# Altium schematic sheet My_CryStal.SchDoc: F103C8T6
size A4; Revision: HPP.纸飞机; Num: 20161008.01
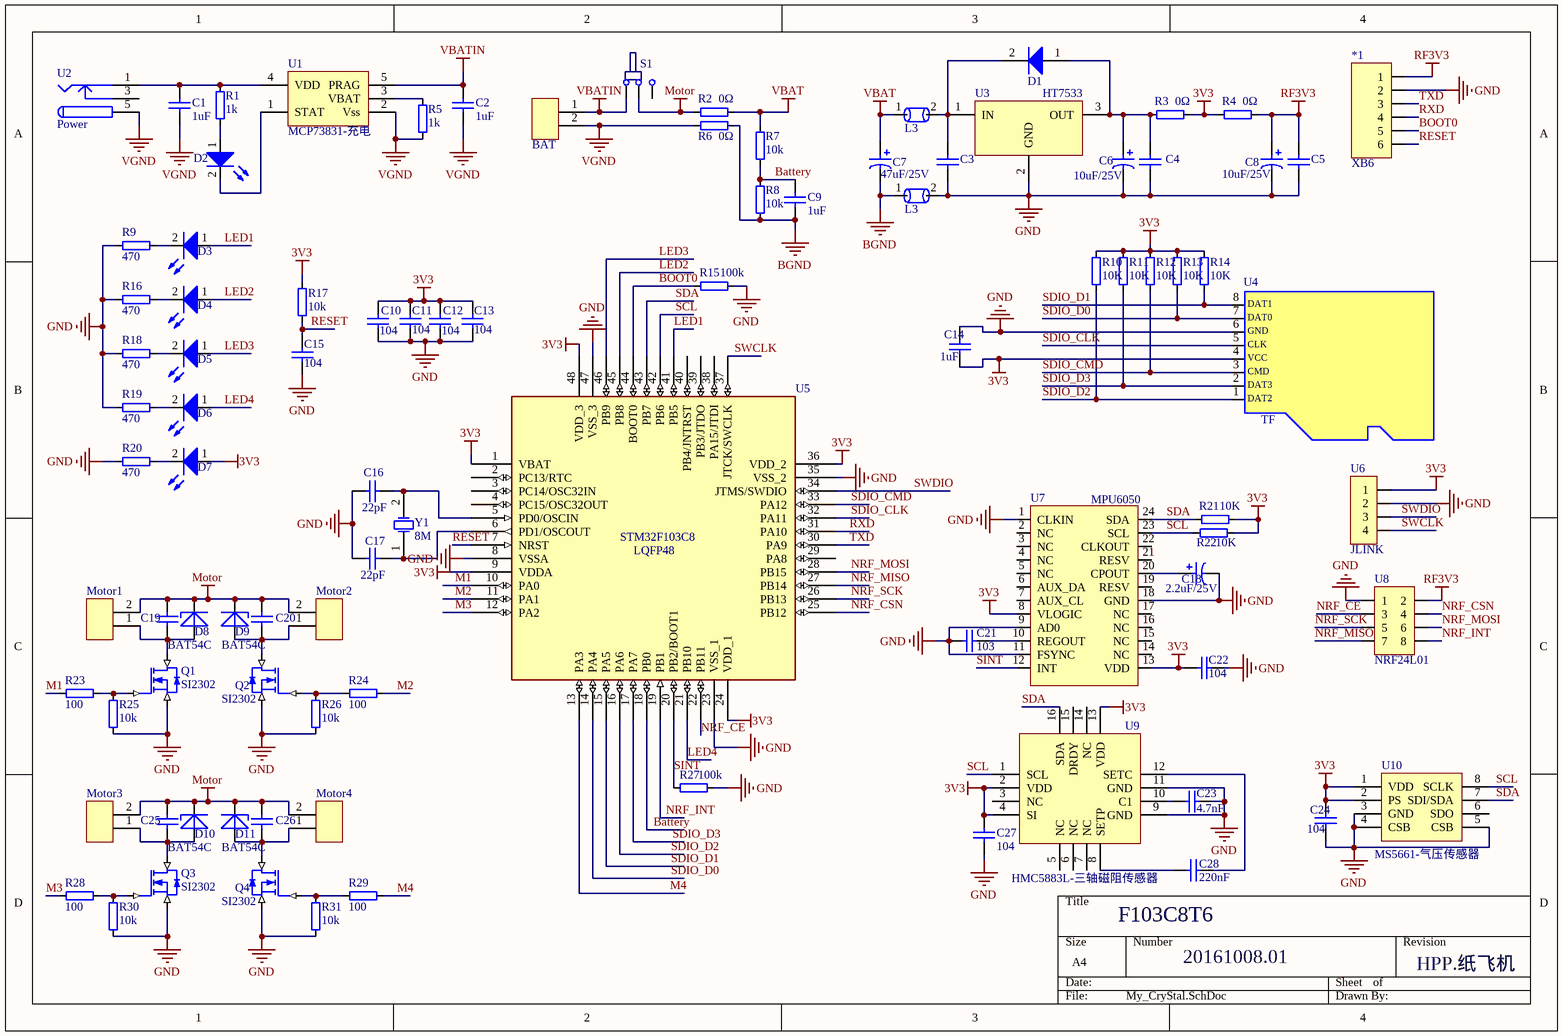
[diagram p0: My_CryStal.SchDoc]

## Parts
*1  XB6  [SIP6]
*2  L3  [2010]
*3  L3  [2010]
C1  1uF  [0805 - duplicate]
C2  1uF  [0805 - duplicate]
C3  104  [0805 - duplicate]  (value not drawn)
C4  104  [0805 - duplicate]  (value not drawn)
C5  104  [0805 - duplicate]  (value not drawn)
C6  10uF/25V  [1206]
C7  47uF/25V  [1206]
C8  10uF/25V  [1206]
C9  1uF  [0805 - duplicate]
C10  104  [0805 - duplicate]
C11  104  [0805 - duplicate]
C12  104  [0805 - duplicate]
C13  104  [0805 - duplicate]
C14  1uF  [0805 - duplicate]
C15  104  [0805 - duplicate]
C16  value 22pF  [0805 - duplicate]  (hidden comment: Cap)
C17  value 22pF  [0805 - duplicate]  (hidden comment: Cap)
C18  2.2uF/25V  [1206]
C19  104  [0805 - duplicate]  (value not drawn)
C20  104  [0805 - duplicate]  (value not drawn)
C21  103  [0805 - duplicate]
C22  104  [0805 - duplicate]
C23  4.7nF  [0805 - duplicate]
C24  104  [0805 - duplicate]
C25  104  [0805 - duplicate]  (value not drawn)
C26  104  [0805 - duplicate]  (value not drawn)
C27  104  [0805 - duplicate]
C28  220nF  [0805 - duplicate]
CON1  BAT  [SIP2]
CON2  Motor1  [SIP2]
CON3  Motor2  [SIP2]
CON4  Motor3  [SIP2]
CON5  Motor4  [SIP2]
D1  Diode  [DIODE-SMB]  (value not drawn)
D2  LED  [LED]  (value not drawn)
D3  LED  [LED]  (value not drawn)
D4  LED  [LED]  (value not drawn)
D5  LED  [LED]  (value not drawn)
D6  LED  [LED]  (value not drawn)
D7  LED  [LED]  (value not drawn)
D8  BAT54C  [DIODE-SMB]
D9  BAT54C  [DIODE-SMB]
D10  BAT54C  [DIODE-SMB]
D11  BAT54C  [DIODE-SMB]
Q1  SI2302  [SOT-23]
Q2  SI2302  [SOT-23]
Q3  SI2302  [SOT-23]
Q4  SI2302  [SOT-23]
R1  1k  [0805 - duplicate]
R2  0Ω  [0805 - duplicate]
R3  0Ω  [0805 - duplicate]
R4  0Ω  [0805 - duplicate]
R5  1k  [0805 - duplicate]
R6  0Ω  [0805 - duplicate]
R7  10k  [0805 - duplicate]
R8  10k  [0805 - duplicate]
R9  470  [0805 - duplicate]
R10  10K  [0805 - duplicate]
R11  10K  [0805 - duplicate]
R12  10K  [0805 - duplicate]
R13  10K  [0805 - duplicate]
R14  10K  [0805 - duplicate]
R15  100k  [0805 - duplicate]
R16  470  [0805 - duplicate]
R17  10k  [0805 - duplicate]
R18  470  [0805 - duplicate]
R19  470  [0805 - duplicate]
R20  470  [0805 - duplicate]
R21  10K  [0805 - duplicate]
R22  10K  [0805 - duplicate]
R23  100  [0805 - duplicate]
R24  100  [0805 - duplicate]
R25  10k  [0805 - duplicate]
R26  10k  [0805 - duplicate]
R27  100k  [0805 - duplicate]
R28  100  [0805 - duplicate]
R29  100  [0805 - duplicate]
R30  10k  [0805 - duplicate]
R31  10k  [0805 - duplicate]
S1  SW  [SWITCH_B1]  (value not drawn)
U1  MCP73831-充电  [SOT23-5]
U2  Power  [USB5]
U3  HT7533  [SOT-89]
U4  TF  [SDCARD_L]
U5  STM32F103C8T6-1  [LQFP48S]  (value not drawn)
U6  JLINK  [SIP4]
U7  MPU6050  [QFN24]
U8  NRF24L01  [DIP8]
U9  HMC5883L-三轴磁阻传感器  [LCC16]
U10  MS5661-气压传感器  [LCC8]
Y1  8M  [XTAL]

## Nets
3V3: C10.2 C11.2 C12.2 C13.2 C14.1 C22.1 C24.1 C27.1 D7.1(A) R3.1 R4.2 R10.1 R11.1 R12.1 R13.1 R14.1 R17.2 R21.1 R22.1 U4.4 U5.1(VBAT) U5.9(VDDA) U5.24(VDD_1) U5.36(VDD_2) U5.48(VDD_3) U6.1 U7.8(VLOGIC) U7.13(VDD) U9.2(VDD) U9.4(SI) U9.13(VDD) U10.1(VDD) U10.2(PS)
BGND: *3.1 C7.2 C9.1 R6.2 R8.1
GND: *1.2 *3.2 C3.1 C4.1 C5.1 C6.2 C8.2 C10.1 C11.1 C12.1 C13.1 C14.2 C15.1 C16.1 C17.1 C18.2 C21.2 C22.2 C23.2 C24.2 C27.2 Q1.3(S) Q2.3(S) Q3.3(S) Q4.3(S) R9.1 R15.1 R16.1 R18.1 R19.1 R20.1 R25.1 R26.1 R27.1 R30.1 R31.1 U3.2(GND) U4.6 U5.8(VSSA) U5.23(VSS_1) U5.35(VSS_2) U5.47(VSS_3) U6.2 U7.1(CLKIN) U7.9(AD0) U7.11(FSYNC) U7.18(GND) U8.1 U9.9(GND) U9.11(GND) U10.3(GND) U10.4(CSB) U10.5(CSB)
Motor: C19.2 C20.2 C25.2 C26.2 CON2.2 CON3.2 CON4.2 CON5.2 D8.2(K) D9.2(K) D10.2(K) D11.2(K) R2.2 S1.2
RF3V3: *1.1 C5.2 C8.1 R4.1 U8.2
VBAT: *2.1 C7.1 R2.1 R7.2
VBATIN: C2.2 CON1.1 S1.1 U1.5(PRAG)
VGND: C1.1 C2.1 CON1.2 R5.1 R6.1 U1.2(Vss) U2.5
Battery: C9.2 R7.1 R8.2 U5.18(PB0)
BOOT0: *1.5 R15.2 U5.44(BOOT0)
LED1: D3.1(A) U5.41(PB5)
LED2: D4.1(A) U5.45(PB8)
LED3: D5.1(A) U5.46(PB9)
LED4: D6.1(A) U5.21(PB10)
M1: R23.1 U5.10(PA0)
M2: R24.1 U5.11(PA1)
M3: R28.1 U5.12(PA2)
M4: R29.1 U5.13(PA3)
NRF_CE: U5.22(PB11) U8.3
NRF_CSN: U5.25(PB12) U8.4
NRF_INT: U5.19(PB1) U8.8
NRF_MISO: U5.27(PB14) U8.7
NRF_MOSI: U5.28(PB15) U8.6
NRF_SCK: U5.26(PB13) U8.5
RESET: *1.6 C15.2 R17.1 U5.7(NRST)
RXD: *1.4 U5.31(PA10)
SCL: R22.2 U5.42(PB6) U7.23(SCL) U9.1(SCL) U10.8(SCLK)
SDA: R21.2 U5.43(PB7) U7.24(SDA) U9.16(SDA) U10.7(SDI/SDA)
SDIO_CLK: U4.5 U5.32(PA11)
SDIO_CMD: R12.2 U4.3 U5.33(PA12)
SDIO_D0: R13.2 U4.7 U5.14(PA4)
SDIO_D1: R14.2 U4.8 U5.15(PA5)
SDIO_D2: R10.2 U4.1 U5.16(PA6)
SDIO_D3: R11.2 U4.2 U5.17(PA7)
SINT: R27.2 U5.20(PB2/BOOT1) U7.12(INT)
SWCLK: U5.37(JTCK/SWCLK) U6.4
SWDIO: U5.34(JTMS/SWDIO) U6.3
TXD: *1.3 U5.30(PA9)
Net*2_2: *2.2 C3.2 D1.2 U3.1(IN)
NetC1_2: C1.2 R1.2 U1.4(VDD) U2.1
NetC4_2: C4.2 C6.1 D1.1 R3.2 U3.3(OUT)
NetC16_2: C16.2 U5.5(PD0/OSCIN) Y1.2(OSC2)
NetC17_2: C17.2 U5.6(PD1/OSCOUT) Y1.1(OSC1)
NetC18_1: C18.1 U7.20(CPOUT)
NetC19_1: C19.1 CON2.1 D8.1(A) Q1.2(D)
NetC20_1: C20.1 CON3.1 D9.1(A) Q2.2(D)
NetC21_1: C21.1 U7.10(REGOUT)
NetC23_1: C23.1 U9.10(C1)
NetC25_1: C25.1 CON4.1 D10.1(A) Q3.2(D)
NetC26_1: C26.1 CON5.1 D11.1(A) Q4.2(D)
NetC28_1: C28.1 U9.8(SETP)
NetC28_2: C28.2 U9.12(SETC)
NetD2_1: D2.1(A) R1.1
NetD2_2: D2.2(K) U1.1(STAT)
NetD3_2: D3.2(K) R9.2
NetD4_2: D4.2(K) R16.2
NetD5_2: D5.2(K) R18.2
NetD6_2: D6.2(K) R19.2
NetD7_2: D7.2(K) R20.2
NetQ1_1: Q1.1(G) R23.2 R25.2
NetQ2_1: Q2.1(G) R24.2 R26.2
NetQ3_1: Q3.1(G) R28.2 R30.2
NetQ4_1: Q4.1(G) R29.2 R31.2
NetR5_2: R5.2 U1.3(VBAT)

Not connected (* = marked no-connect by the designer): S1 3; U2 3; U5 2(PC13/RTC) 3(PC14/OSC32IN) 4(PC15/OSC32OUT) 29(PA8) 38(PA15/JTDI) 39(PB3/JTDO) 40(PB4/JNTRST); U7 2(NC) 3(NC) 4(NC) 5(NC) 6(AUX_DA) 7(AUX_CL) 14(NC) 15(NC) 16(NC) 17(NC) 19(RESV) 21(RESV) 22(CLKOUT); U9 3(NC) 5(NC) 6(NC) 7(NC) 14(NC) 15(DRDY); U10 6(SDO)

## Notes on the sheet
- (in symbol STM32F103C8T6-1) STM32F103C8; LQFP48
- (in symbol TF) DAT1; DAT0; GND; CLK; VCC; CMD; DAT3; DAT2

## Library data of the parts
C1 C2 C9 C14 = CAP SMD 0603  X5R 1µF 25V 10%: 0805; Rated voltage: 25V; Tolerance: 10%; Manufacturer: *; Manufacturer P/N: *; Order code Farnell: 1288202RL; Value: 1uF; Power: *; Technology: X5R; Temperature  Factor: *; Temperature Max: +125°C; Temperature Min: -55°C; STS Code: *
C3-C5 = C1: 0805; Published: 8-Jun-2000; LatestRevisionDate: 17-Jul-2002; LatestRevisionNote: Re-released for DXP Platform.; PackageReference: RAD-0.3; Publisher: Altium Limited
C6-C8 C18 = Cap Pol: 0805; Published: 8-Jun-2000; LatestRevisionDate: 17-Jul-2002; LatestRevisionNote: Re-released for DXP Platform.; PackageReference: RB7.6-15; Publisher: Altium Limited
C10-C13 C15 C19 C20 C25 C26 = C1: Cap; Published: 8-Jun-2000; LatestRevisionDate: 17-Jul-2002; LatestRevisionNote: Re-released for DXP Platform.; PackageReference: RAD-0.3; Publisher: Altium Limited
C16 C17 = Cap: Capacitor; Published: 8-Jun-2000; LatestRevisionDate: 17-Jul-2002; LatestRevisionNote: Re-released for DXP Platform.; PackageReference: RAD-0.3; Publisher: Altium Limited
C21-C24 C27 C28 = CAP SMD 0603  X5R 1µF 25V 10%: 0805; Value: 1uF; Rated voltage: 25V; Tolerance: 10%; Manufacturer: *; Manufacturer P/N: *; Order code Farnell: 1288202RL; Power: *; Technology: X5R; Temperature  Factor: *; Temperature Max: +125°C; Temperature Min: -55°C; STS Code: *
CON1-CON5 = CON2
D1 = Diode: 整流二极管; Published: 8-Jun-2000; LatestRevisionDate: 17-Jul-2002; LatestRevisionNote: Re-released for DXP Platform.; DatasheetDocument: 1998; PackageDocument: Aug-1999; PackageReference: DO-41; Publisher: Altium Limited; Code_JEDEC: DO-204-AL; ComponentLink1Description: Manufacturer Link; ComponentLink1URL: http://www.fairchildsemi.com/; ComponentLink2Description: Datasheet; ComponentLink2URL: http://www.fairchildsemi.com/ds/1N%2F1N4001.pdf
D2-D7 = LED: 发光二极管; Published: 8-Jun-2000; LatestRevisionDate: 17-Dec-2003; LatestRevisionNote: PCB Footprint replaced.; DatasheetDocument: 16-Apr-2002; PackageDocument: 16-Apr-2002; PackageReference: 3.5X2.8X1.9; Publisher: Altium Limited
D8-D11 = TVS
Q1-Q4 = IRF740: N-Channel MOSFET
R1-R31 = RES_1
U1 = MCP73831
U5 = STM32F103C8T6-1: Manuf_1: STM; Ref St: 9175981; Provided: ST; Description: Medium-density performance line ARM-based 32-bit MCU with 64KB Flash, USB, CAN, 7 timers, 2 ADCs; Footprint: QFP48 7X7; Manuf_Part_1: STM32F103C8T6; Order: STM32F103C8T6; Distrib: ST
U6 = X4
U8 = Header 4X2: Header, 6-Pin; LatestRevisionDate: *; LatestRevisionNote: *; Publisher: *
U9 = HMC5883L
U10 = MS5611
Y1 = XTAL: Crystal Oscillator; Published: 8-Jun-2000; LatestRevisionDate: 17-Jul-2002; LatestRevisionNote: Re-released for DXP Platform.; PackageReference: R38; Publisher: Altium Limited